# Altium schematic sheet SafeCharge.SchDoc
size A
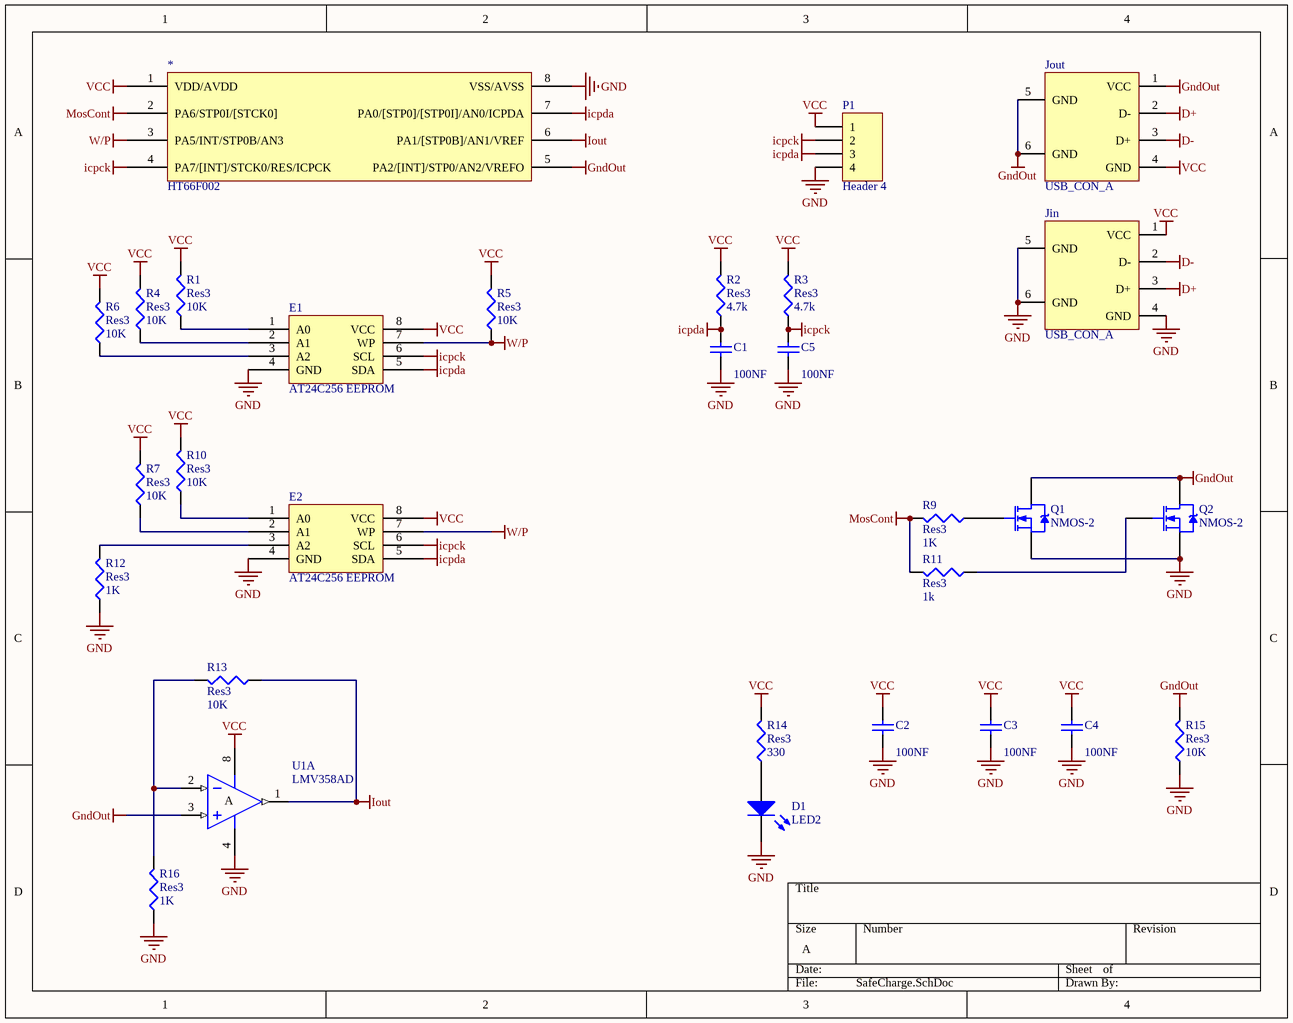
[diagram p0: SafeCharge.SchDoc]

## Parts
*  HT66F002  [SO8]
C1  value 100NF  [6-0805_N]  (hidden comment: Cap Semi)
C2  value 100NF  [6-0805_N]  (hidden comment: Cap Semi)
C3  value 100NF  [6-0805_N]  (hidden comment: Cap Semi)
C4  value 100NF  [6-0805_N]  (hidden comment: Cap Semi)
C5  value 100NF  [6-0805_N]  (hidden comment: Cap Semi)
D1  LED2  [C1206]
E1  AT24C256 EEPROM  [SOIC8_L]
E2  AT24C256 EEPROM  [SOIC8_L]
Jin  USB_CON_A  [USB_CON_A]
Jout  USB_CON_A  [USB_CON_A]
P1  Header 4  [HDR1X4]
Q1  NMOS-2  [SOT-23_N]
Q2  NMOS-2  [SOT-23_N]
R1  Res3  value 10K  [6-0805_N]
R2  Res3  value 4.7k  [6-0805_N]
R3  Res3  value 4.7k  [6-0805_N]
R4  Res3  value 10K  [6-0805_N]
R5  Res3  value 10K  [6-0805_N]
R6  Res3  value 10K  [6-0805_N]
R7  Res3  value 10K  [6-0805_N]
R9  Res3  value 1K  [6-0805_N]
R10  Res3  value 10K  [6-0805_N]
R11  Res3  value 1k  [6-0805_N]
R12  Res3  value 1K  [6-0805_N]
R13  Res3  value 10K  [6-0805_N]
R14  Res3  value 330  [6-0805_N]
R15  Res3  value 10K  [6-0805_N]
R16  Res3  value 1K  [6-0805_N]
U1  LMV358AD  [SO8_N]  (part A of 2)

## Nets
D+: Jin.3(D+) Jout.2(D-)
D-: Jin.2(D-) Jout.3(D+)
GND: *.8(VSS/AVSS) C1.1 C2.1 C3.1 C4.1 C5.1 D1.2(K) E1.4(GND) E2.4(GND) Jin.4(GND) Jin.5(GND) Jin.6(GND) P1.4 Q1.3(S) Q2.3(S) R12.1 R15.1 R16.1 U1.4(V-)
GndOut: *.5(PA2/[INT]/STP0/AN2/VREFO) Jout.1(VCC) Jout.5(GND) Jout.6(GND) Q1.2(D) Q2.2(D) R15.2 U1.3(IN+)
icpck: *.4(PA7/[INT]/STCK0/RES/ICPCK) C5.2 E1.6(SCL) E2.6(SCL) P1.2 R3.1
icpda: *.7(PA0/[STP0]/[STP0I]/AN0/ICPDA) C1.2 E1.5(SDA) E2.5(SDA) P1.3 R2.1
Iout: *.6(PA1/[STP0B]/AN1/VREF) R13.1 U1.1(OUT)
MosCont: *.2(PA6/STP0I/[STCK0]) R9.2 R11.2
VCC: *.1(VDD/AVDD) C2.2 C3.2 C4.2 E1.8(VCC) E2.8(VCC) Jin.1(VCC) Jout.4(GND) P1.1 R1.2 R2.2 R3.2 R4.2 R5.2 R6.2 R7.2 R10.2 R14.2 U1.8(V+)
W/P: *.3(PA5/INT/STP0B/AN3) E1.7(WP) E2.7(WP) R5.1
NetD1_1: D1.1(A) R14.1
NetE1_1: E1.1(A0) R1.1
NetE1_2: E1.2(A1) R4.1
NetE1_3: E1.3(A2) R6.1
NetE2_1: E2.1(A0) R10.1
NetE2_2: E2.2(A1) R7.1
NetE2_3: E2.3(A2) R12.2
NetQ1_1: Q1.1(G) R9.1
NetQ2_1: Q2.1(G) R11.1
NetR13_2: R13.2 R16.2 U1.2(IN-)

## Notes on the sheet
- (in symbol LM358AD, part A) A

## Library data of the parts
C1-C5 = Cap Semi: Capacitor (Semiconductor SIM Model); Published: 8-Jun-2000; LatestRevisionDate: 29-May-2009; LatestRevisionNote: IPC-7351 Footprint Added.; PackageReference: C1206; Publisher: Altium Limited; PackageDescription: Chip Capacitor
D1 = LED2: Typical RED, GREEN, YELLOW, AMBER GaAs LED; Published: 8-Jun-2000; LatestRevisionDate: 17-Jul-2002; LatestRevisionNote: Re-released for DXP Platform.; PackageVersion: Feb-2002; PackageReference: 3.2X1.6X1.1; Publisher: Altium Limited; PackageDescription: SM LED; 2 Flat Leads
P1 = Header 4: Header, 4-Pin; LatestRevisionDate: 17-Jul-2002; LatestRevisionNote: Re-released for DXP Platform.; Publisher: Altium Limited
Q1 Q2 = NMOS-2: N-Channel Power MOSFET; Note: Pin 2 is electrically connected to pin 4.; Published: 8-Jun-2000; LatestRevisionDate: 17-Jul-2002; LatestRevisionNote: Re-released for DXP Platform.; DatasheetVersion: PD-9.814; PackageVersion: Feb-1997; PackageReference: TO-220AB; Publisher: Altium Limited; PackageDescription: TO, Thru-Hole, Vertical, Heatsink Mounted; 3 In-Line Leads; Pitch 2.54 mm; ComponentLink1Description: Manufacturer Link; ComponentLink1URL: http://www.irf.com/
R1-R7 R9-R16 = Res3: Resistor; Published: 8-Jun-2000; LatestRevisionDate: 29-May-2009; LatestRevisionNote: IPC-7351 Footprint Added.; PackageReference: J1-0603; Publisher: Altium Limited; PackageDescription: Chip Resistor
U1 = LM358AD: Low-Power Dual Operational Amplifier; Published: 24-Aug-2001; LatestRevisionDate: 13-Apr-2006; LatestRevisionNote: IPC-7351 Footprint Added.; DatasheetVersion: Jun-1998; PackageVersion: Dec-2002; PackageReference: SO8; Publisher: Altium Limited; PackageDescription: 8-Pin Small Outline Integrated Circuit 1.27 mm Pitch; Code_JEDEC: MS-012-AA; Code_IPC: SOIC127P600-8; ComponentLink1Description: Manufacturer Link; ComponentLink1URL: http://www.st.com/; ComponentLink2Description: Datasheet; ComponentLink2URL: http://www.st.com/stonline/products/literature/ds/2163/lm358.pdf